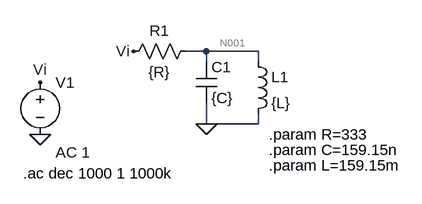
[diagram p0: schematic fase.asc]
fase.asc, the LTspice schematic file:
Version 4
SHEET 1 1232 680
WIRE 784 240 752 240
WIRE 864 240 784 240
WIRE 784 256 784 240
WIRE 864 256 864 240
WIRE 784 352 784 320
WIRE 864 352 864 336
WIRE 864 352 784 352
FLAG 528 288 Vi
FLAG 528 368 0
FLAG 784 352 0
FLAG 672 240 Vi
SYMBOL voltage 528 272 R0
WINDOW 123 24 124 Left 2
WINDOW 39 0 0 Left 0
SYMATTR InstName V1
SYMATTR Value ""
SYMATTR Value2 AC 1
SYMBOL res 768 224 R90
WINDOW 0 0 56 VBottom 2
WINDOW 3 32 56 VTop 2
SYMATTR InstName R1
SYMATTR Value {R}
SYMBOL cap 768 256 R0
SYMATTR InstName C1
SYMATTR Value {C}
SYMBOL ind 848 240 R0
SYMATTR InstName L1
SYMATTR Value {L}
TEXT 502 428 Left 2 !.ac dec 1000 1 1000k
TEXT 880 368 Left 2 !.param R=333
TEXT 880 392 Left 2 !.param C=159.15n
TEXT 880 416 Left 2 !.param L=159.15m

The netlist it stands for:
* fase.asc
V1 Vi 0 AC 1
R1 N001 Vi {R}
C1 N001 0 {C}
L1 N001 0 {L}
.ac dec 1000 1 1000k
.param R=333
.param C=159.15n
.param L=159.15m
.backanno
.end

* Results of the author's LTspice run, read from the files saved beside the schematic
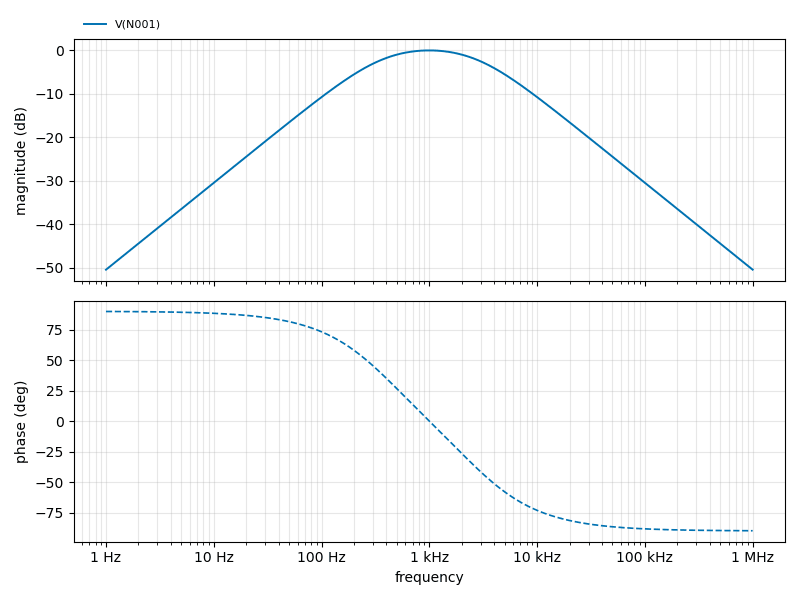
[diagram p1: AC Analysis of fase.asc, plotted from the saved traces]
* AC Analysis, 1 run:
*   V(N001): -50.45 dB at 1 Hz, -50.45 dB at 1 MHz, peak -0.00 dB at 1 kHz, 3 dB below the peak at 302.5 Hz and 3.306 kHz